# Altium schematic sheet Overview.SchDoc
size A; SheetNumber: 1; SheetTotal: 3
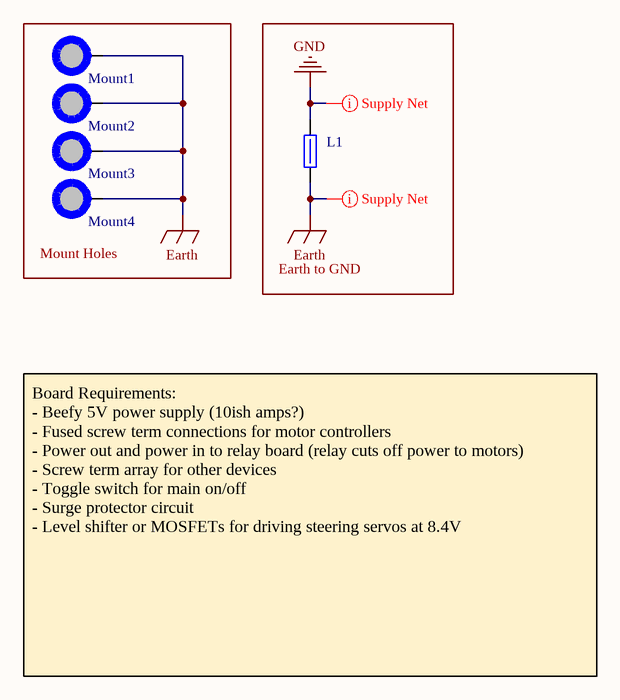
[diagram p0: Overview.SchDoc]

## Parts
L1  742792040  [[Ferrite] SMD Bead 0805 (2)]  (value not drawn)
Mount1  M3 Mount Hole  [[Mount] M3 Mount Hole]  (value not drawn)  (no BOM)
Mount2  M3 Mount Hole  [[Mount] M3 Mount Hole]  (value not drawn)  (no BOM)
Mount3  M3 Mount Hole  [[Mount] M3 Mount Hole]  (value not drawn)  (no BOM)
Mount4  M3 Mount Hole  [[Mount] M3 Mount Hole]  (value not drawn)  (no BOM)

## Blocks framed on the sheet
Mount Holes: Mount1-Mount4
Earth to GND: L1

## Nets
Earth: L1.1 Mount1.1 Mount2.1 Mount3.1 Mount4.1
GND: L1.2

## Layout directives
net class Supply_Nets: Earth, GND

## Notes on the sheet
- Board Requirements:
  - Beefy 5V power supply (10ish amps?)
  - Fused screw term connections for motor controllers
  - Power out and power in to relay board (relay cuts off power to motors)
  - Screw term array for other devices
  - Toggle switch for main on/off
  - Surge protector circuit
  - Level shifter or MOSFETs for driving steering servos at 8.4V

## Library data of the parts
L1 = [Ferrite] SMD Ferrite Bead (2): Supplier 1: DigiKey; Supplier Part Number 1: 732-1620-1-ND
Mount1-Mount4 = [Mount] M3 Mount Hole: Place at least 4.5mm from board edge. Plated.